# Altium schematic sheet Master.SchDoc: Frame13ProDock
size A3; Author: ExoticDG / Nova; DrawnBy: ExoticDG / Nova; Engineer: ExoticDG / Nova; SheetNumber: 1; SheetTotal: 1